# EAGLE design picWAVE (EAGLE 7.7.0)
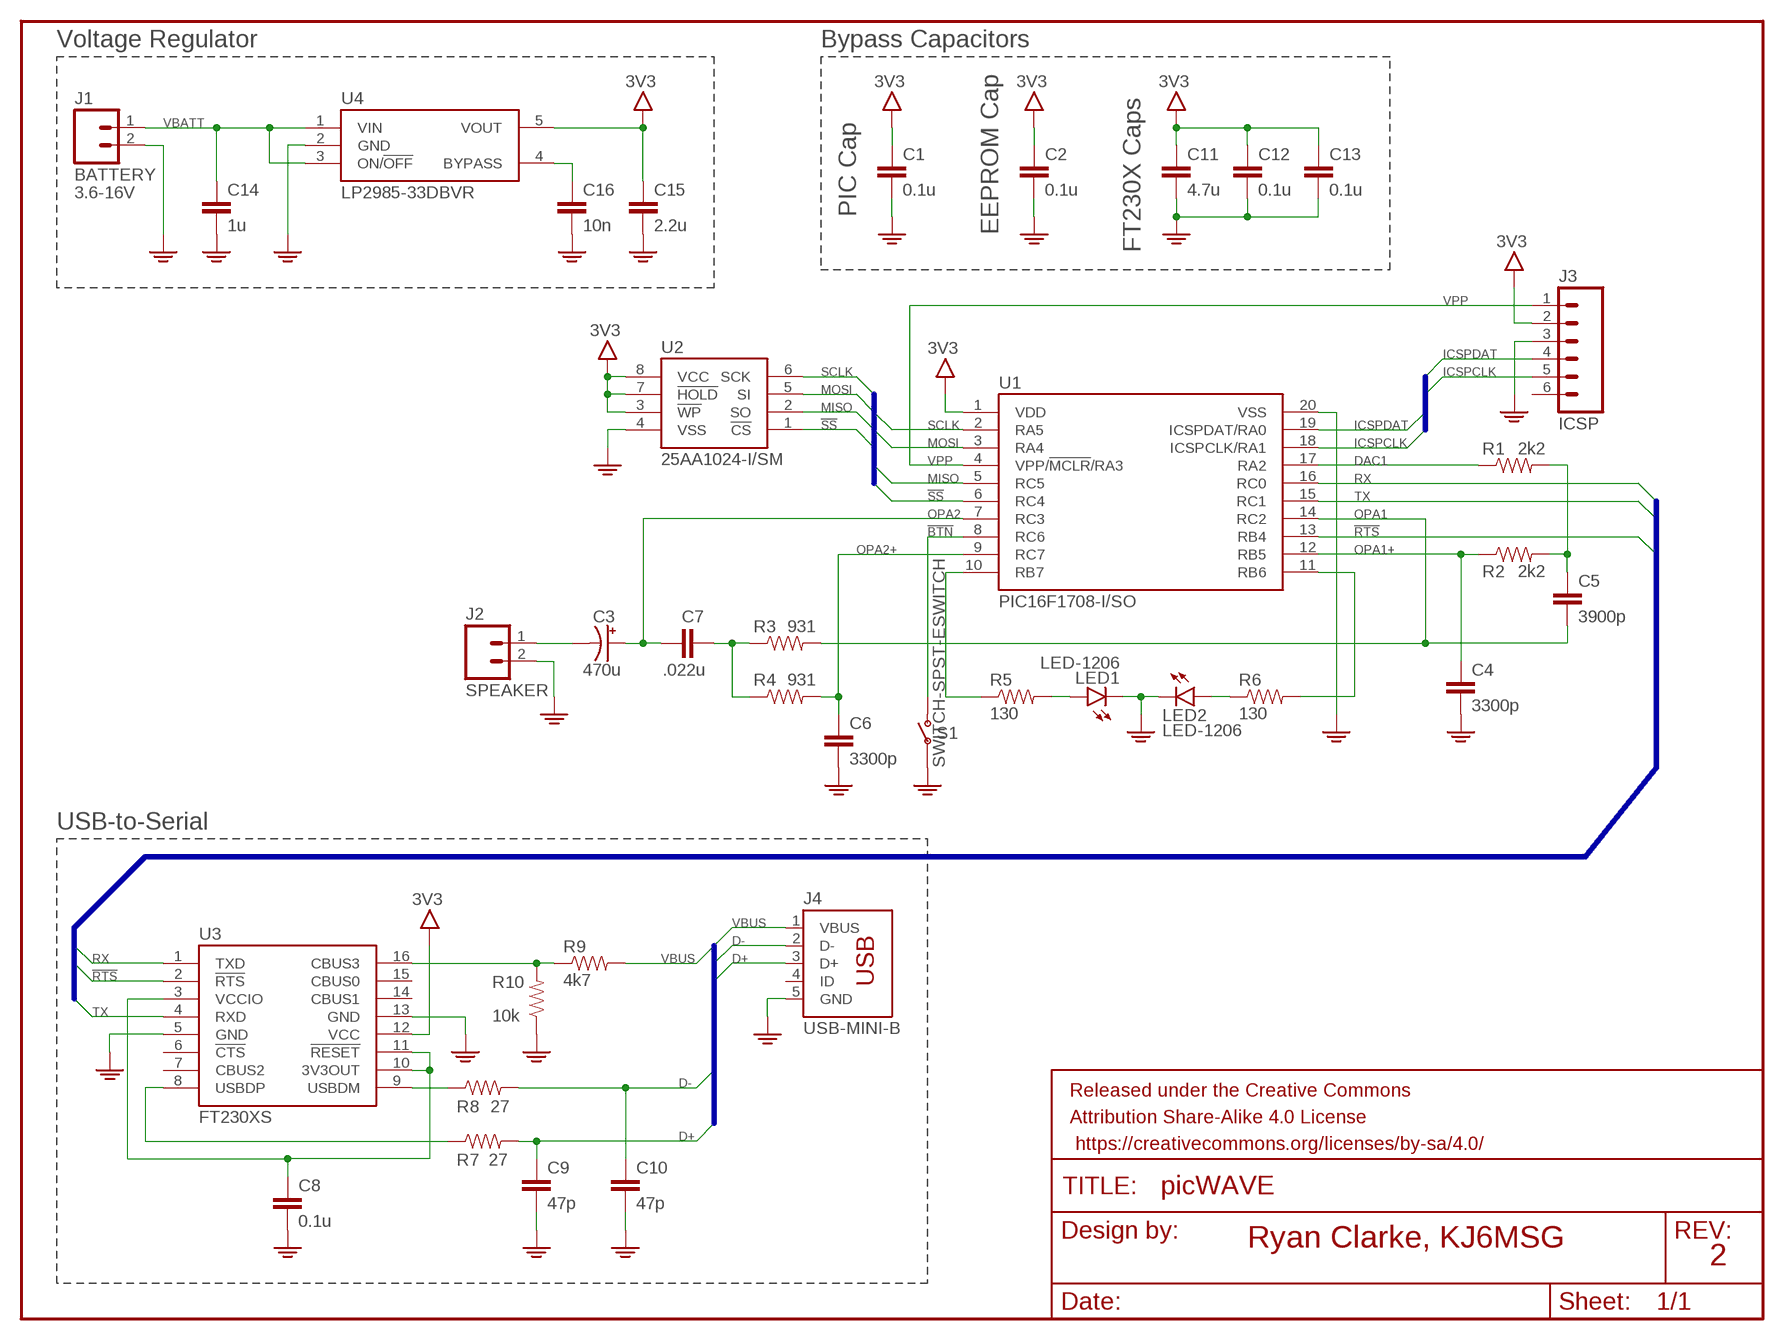
[diagram p0: schematic, sheet 1]

## Parts
C1  0.1u  CAPACITOR-1206  [1206]
C2  0.1u  CAPACITOR-1206  [1206]
C3  470u  CAPACITOR-POL-NL1GS  [NL1GS]
C4  3300p  CAPACITOR-1206  [1206]
C5  3900p  CAPACITOR-1206  [1206]
C6  3300p  CAPACITOR-1206  [1206]
C7  .022u  CAPACITOR-1206  [1206]
C8  0.1u  CAP1206  [1206@1]
C9  47p  CAP1206  [1206@1]
C10  47p  CAP1206  [1206@1]
C11  4.7u  CAP1206  [1206@1]
C12  0.1u  CAP1206  [1206@1]
C13  0.1u  CAP1206  [1206@1]
C14  1u  CAPACITOR-1206  [1206]
C15  2.2u  CAPACITOR-1206  [1206]
C16  10n  CAPACITOR-1206  [1206]
FRAME1  FRAME-LETTERNO_PACKAGE  [DUMMY]
J1  BATTERY  M02-MOLEX  [22-05-3021]
J2  SPEAKER  M02-MOLEX  [22-05-3021]
J3  ICSP  M06  [1X06]
J4  USB-MINI-B  USB-MINI-B-PTH  [XM7D-0512]
LED1  LED-1206  [LED-1206]
LED2  LED-1206  [LED-1206]
R1  2k2  RESISTOR1206  [1206]
R2  2k2  RESISTOR1206  [1206]
R3  931  RESISTOR1206  [1206]
R4  931  RESISTOR1206  [1206]
R5  130  RESISTOR1206  [1206]
R6  130  RESISTOR1206  [1206]
R7  27  RESISTOR1206  [1206]
R8  27  RESISTOR1206  [1206]
R9  4k7  RESISTOR1206  [1206]
R10  10k  RESISTOR1206  [1206]
S1  SWITCH-SPST-ESWITCH  [KS-00Q-01]
U1  PIC16F1708-I/SO  [SOIC-20-W]
U2  25AA1024-I/SM  [SOIJ-8]
U3  FT230XS  [SSOP-16]
U4  LP2985-33DBVR  LP2985  [SOT-23-5]

## Nets
3V3: C1.1 C2.1 C11.1 C12.1 C13.1 C15.1 J3.2 U1.1(VDD) U2.3(!WP!) U2.7(!HOLD!) U2.8(VCC) U3.12(VCC) U4.5(VOUT)
!BTN!: S1.2 S1.4 U1.8(RC6)
!RTS!: U1.13(RB4) U3.2(!RTS!)
!SS!: U1.6(RC4) U2.1(!CS!)
D+: C9.1 J4.3(D+) R7.2
D-: C10.1 J4.2(D-) R8.2
DAC1: R1.1 U1.17(RA2)
GND: C1.2 C2.2 C4.2 C6.2 C8.2 C9.2 C10.2 C11.2 C12.2 C13.2 C14.2 C15.2 C16.2 J1.2 J2.2 J3.3 J4.5(GND) LED1.C LED2.C R10.1 S1.1 S1.3 U1.20(VSS) U2.4(VSS) U3.5(GND) U3.13(GND) U4.2(GND)
ICSPCLK: J3.5 U1.18(ICSPCLK/RA1)
ICSPDAT: J3.4 U1.19(ICSPDAT/RA0)
LED1: R5.1 U1.10(RB7)
LED2: R6.2 U1.11(RB6)
MISO: U1.5(RC5) U2.2(SO)
MOSI: U1.3(RA4) U2.5(SI)
N$1: C16.1 U4.4(BYPASS)
N$2: R7.1 U3.8(USBDP)
N$3: C5.1 R1.2 R2.2
N$4: C7.1 R3.1 R4.1
N$5: C3.- J2.1
N$10: C8.1 U3.3(VCCIO) U3.10(3V3OUT) U3.11(!RESET!)
N$11: R8.1 U3.9(USBDM)
N$13: R9.1 R10.2 U3.16(CBUS3)
N$14: LED2.A R6.1
N$16: LED1.A R5.2
OPA1: C5.2 R3.2 U1.14(RC2)
OPA1+: C4.1 R2.1 U1.12(RB5)
OPA2: C3.+ C7.2 U1.7(RC3)
OPA2+: C6.1 R4.2 U1.9(RC7)
RX: U1.16(RC0) U3.1(TXD)
SCLK: U1.2(RA5) U2.6(SCK)
TX: U1.15(RC1) U3.4(RXD)
VBATT: C14.1 J1.1 U4.1(VIN) U4.3(ON/!OFF!)
VBUS: J4.1(VBUS) R9.2
VPP: J3.1 U1.4(VPP/!MCLR!/RA3)
Unconnected: J3.6 J4.4(ID) U3.6(!CTS!) U3.7(CBUS2) U3.14(CBUS1) U3.15(CBUS0)

## Buses
SCLK,MOSI,MISO,!SS!
TX,RX,!RTS!
ICSPDAT,ICSPCLK
VBUS,D-,D+

## Notes on the sheet
- Voltage Regulator | Bypass Capacitors
- 3.6-16V
- PIC Cap
- EEPROM Cap
- FT230X Caps
- USB-to-Serial
- Ryan Clarke, KJ6MSG
- 2

## Library data of the parts
C1 C2 C4-C7 C14-C16 = kj6msg:CAPACITOR: Capacitor SparkFun
C3 = kj6msg:CAPACITOR-POL: Polarized Capacitor SparkFun
C8-C13 = kj6msg:CAP
FRAME1 = SparkFun-Aesthetics:FRAME-LETTER: Schematic Frame Standard 8.5x11 US Letter frame; DESIGNER: Nobody; VERSION: v01
J1 J2 = kj6msg:M02: 2-pin 0.1" Header Ryan Clarke, KJ6MSG; DIGI-KEY: WM4300-ND; MANUFACTURER: Molex; PART-NO: 0022053021
J3 = kj6msg:M06: 6-pin 0.1" Header SparkFun
J4 = kj6msg:USB-MINI-B: USB mini-B Ryan Clarke, KJ6MSG
LED1 LED2 = kj6msg:LED: LED SparkFun
R1-R10 = kj6msg:RESISTOR: Resistor SparkFun
S1 = kj6msg:SWITCH-SPST: SPST Switch Ryan Clarke, KJ6MSG; DIGI-KEY: EG4788-ND; MANUFACTURER: E-Switch; PART-NO: KS-00Q-01
U1 = kj6msg:PIC16F1708-*/: Microchip PIC16F1708 20-pin, 8-bit microcontroller Ryan Clarke, KJ6MSG
U2 = kj6msg:25AA1024: Microchip 25AA1024 8-pin, 1 Mb SPI EEPROM Ryan Clarke, KJ6MSG
U3 = kj6msg:FT230X: FTDI FT230X USB to Basic UART IC Ryan Clarke, KJ6MSG
U4 = kj6msg:LP2985: LP2985 Ryan Clarke, KJ6MSG

## Board
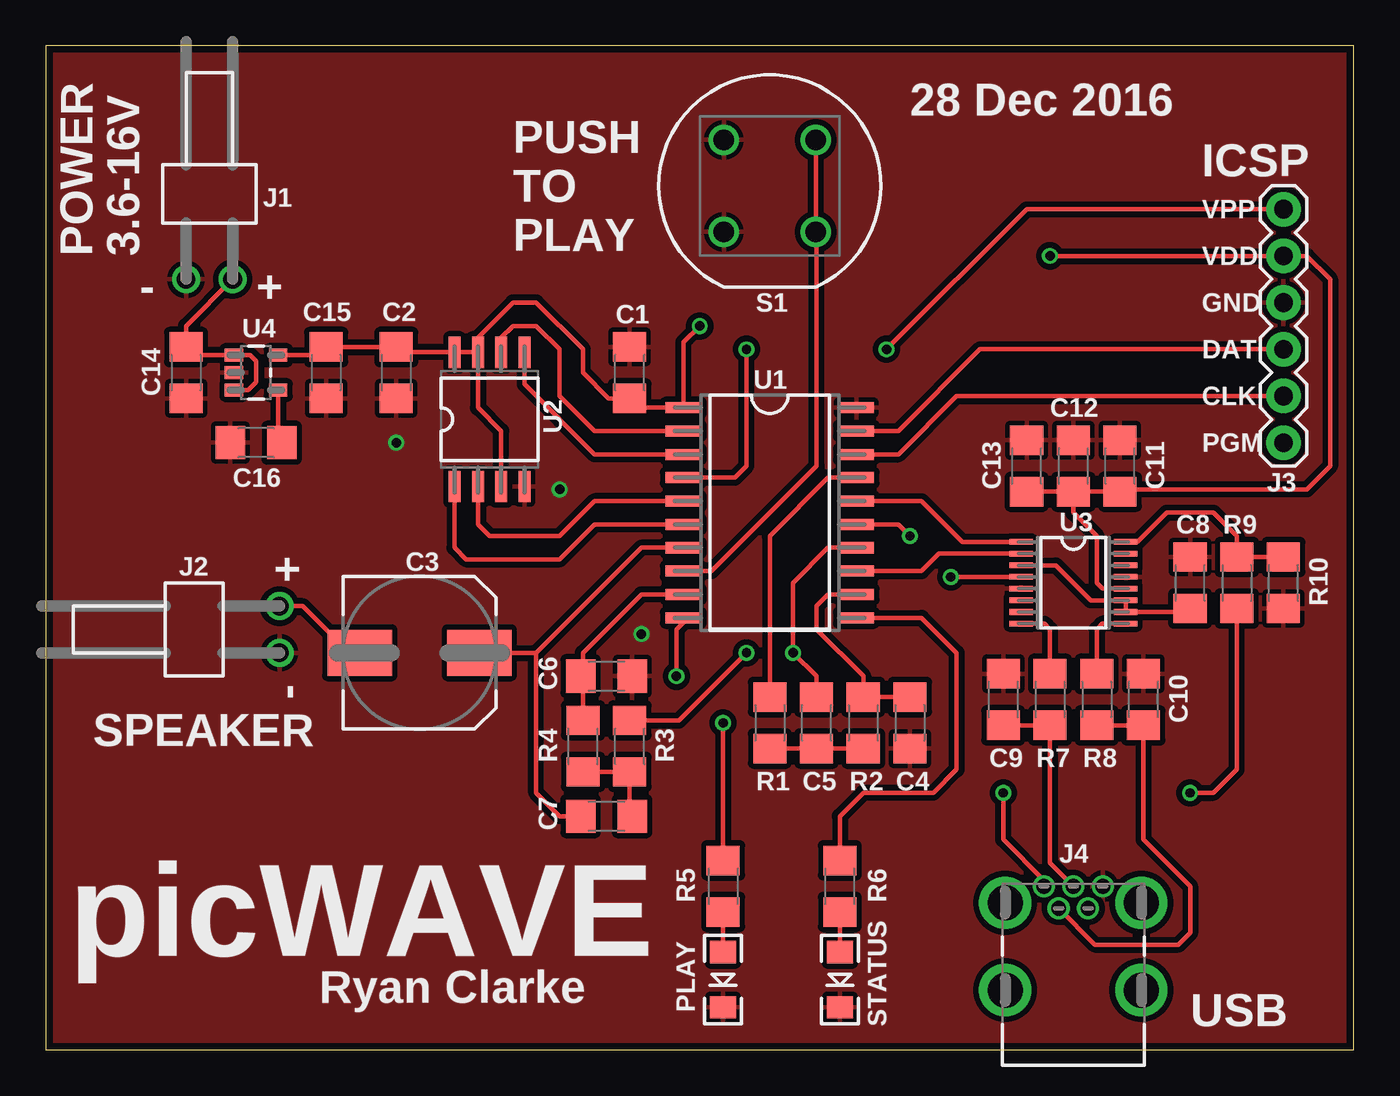
[diagram p1: board, top side]
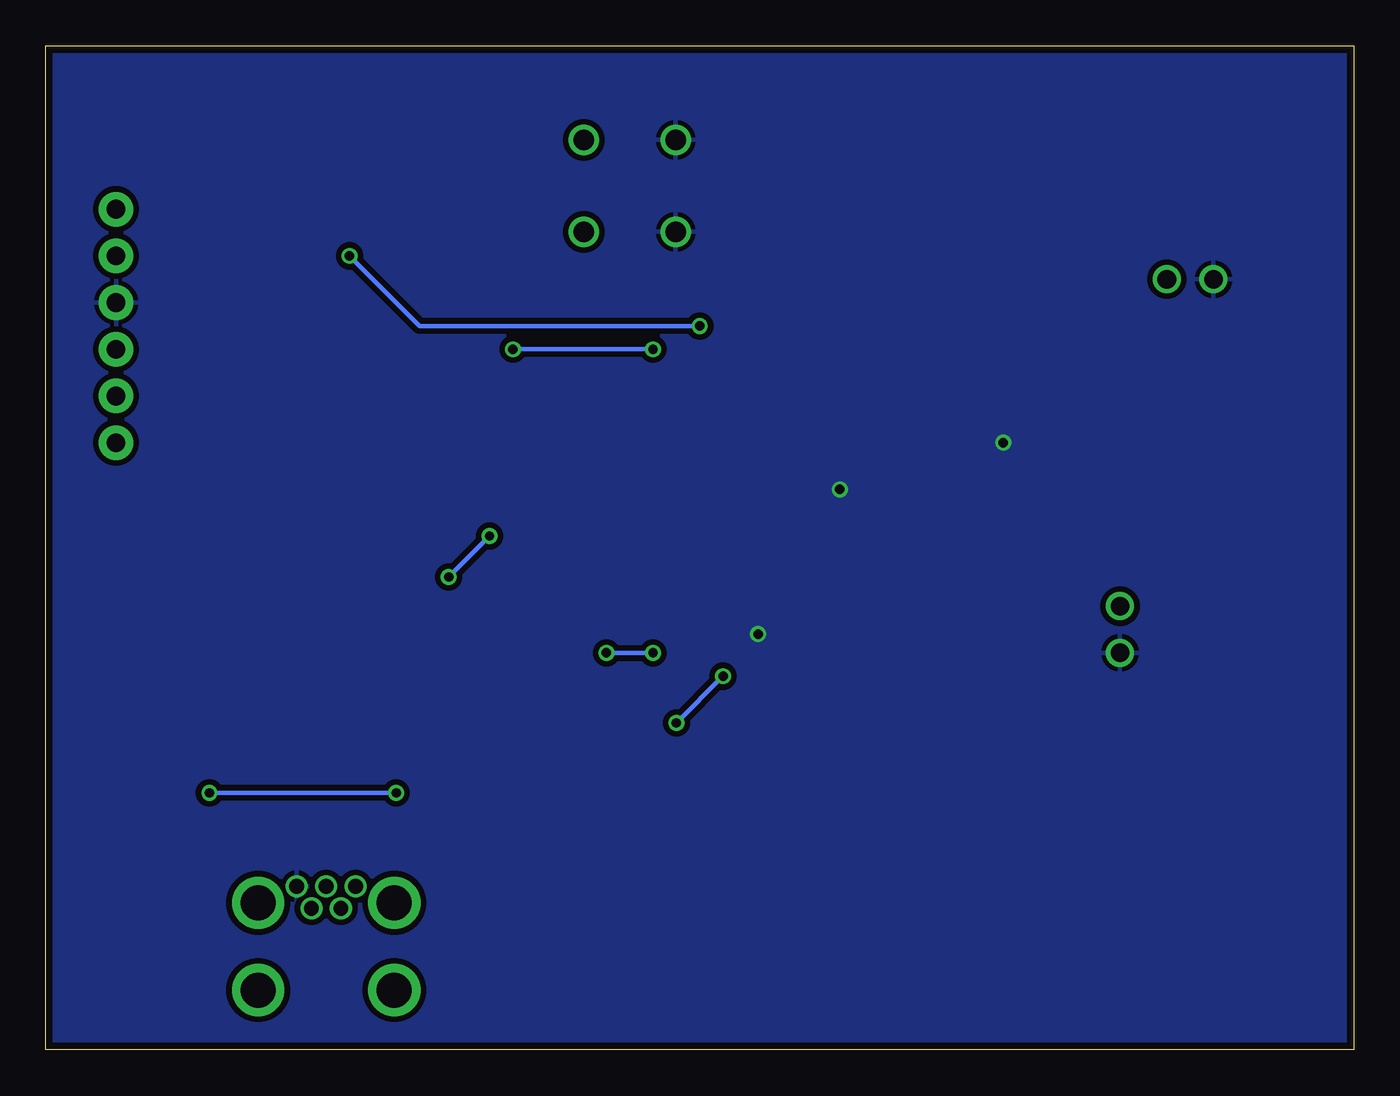
[diagram p2: board, bottom side, seen from below]

Size 71.12 x 54.6 mm. Coordinates in mm from the lower left corner, seen from the top.
Outline: 0,0 71.12,0 71.12,54.6 0,54.6 0,0
Copper layers (1*16): Top 0.0356mm / dielectric 1.5011mm / Bottom 0.0356mm
Design rules "oshpark-2layer": minimum track width 6mil, minimum drill 13mil, track to track 6mil, track to pad 6mil, pad to pad 6mil, via to via 6mil, smd to smd 6mil, copper to edge 15mil, drill to drill 6mil, minimum pad ring 7mil, minimum via ring 7mil, stop-mask expansion 2.5mil, vias tented up to drill 0mil, thermal gap 10mil

### Footprints (pad centres in the part's own frame; a part is rotated, then mirrored left to right if it is on the bottom)
1206 = smd 1.6 x 1.8: 1 -1.4,0; 2 1.4,0
NL1GS = smd 2.5 x 3.5: + 0,3.25; - 0,-3.25
1206@1 = smd 1.6 x 1.8: 1 -1.4,0; 2 1.4,0
22-05-3021 = drill 1.016: 1 1.27,0; 2 -1.27,0
1X06 = drill 1.016 pad 1.88: 1 0,0; 2 2.54,0; 3 5.08,0; 4 7.62,0; 5 10.16,0; 6 12.7,0
XM7D-0512 = drill 0.8: 1 1.6,0; 2 0.8,1.2; 3 0,0; 4 -0.8,1.2; 5 -1.6,0 | drill 1.9: P$1 -3.7,0.9; P$2 3.7,0.9; P$3 -3.7,5.65; P$4 3.7,5.65
LED-1206 = smd 1.2 x 1.4: A -1.5,0; C 1.5,0
KS-00Q-01 = drill 1.1: 1 -2.5,2.5; 2 2.5,2.5; 3 -2.5,-2.5; 4 2.5,-2.5
SOIC-20-W = smd 0.6 x 1.95: 1 -5.715,-4.7; 2 -4.445,-4.7; 3 -3.175,-4.7; 4 -1.905,-4.7; 5 -0.635,-4.7; 6 0.635,-4.7; 7 1.905,-4.7; 8 3.175,-4.7; 9 4.445,-4.7; 10 5.715,-4.7; 11 5.715,4.7; 12 4.445,4.7; 13 3.175,4.7; 14 1.905,4.7; 15 0.635,4.7; 16 -0.635,4.7; 17 -1.905,4.7; 18 -3.175,4.7; 19 -4.445,4.7; 20 -5.715,4.7
SOIJ-8 = smd 0.65 x 1.7: 1 -1.905,-3.65; 2 -0.635,-3.65; 3 0.635,-3.65; 4 1.905,-3.65; 5 1.905,3.65; 6 0.635,3.65; 7 -0.635,3.65; 8 -1.905,3.65
SSOP-16 = smd 0.305 x 1.27: 1 -2.223,-2.845; 2 -1.587,-2.845; 3 -0.953,-2.845; 4 -0.318,-2.845; 5 0.318,-2.845; 6 0.953,-2.845; 7 1.587,-2.845; 8 2.223,-2.845; 9 2.223,2.845; 10 1.587,2.845; 11 0.953,2.845; 12 0.318,2.845; 13 -0.318,2.845; 14 -0.953,2.845; 15 -1.587,2.845; 16 -2.223,2.845
SOT-23-5 = smd 0.7 x 1: 1 -0.95,-1.2; 2 0,-1.2; 3 0.95,-1.2; 4 0.95,1.2; 5 -0.95,1.2

### Placement (x,y rotation side)
C1  31.75,36.83 90 top
C2  19.05,36.83 270 top
C3  20.32,21.59 270 top
C4  46.99,17.78 270 top
C5  41.91,17.78 90 top
C6  30.48,20.32 0 top
C7  30.48,12.7 180 top
C8  62.23,25.4 90 top
C9  52.07,19.05 90 top
C10  59.69,19.05 90 top
C11  58.42,31.75 90 top
C12  55.88,31.75 90 top
C13  53.34,31.75 90 top
C14  7.62,36.83 270 top
C15  15.24,36.83 270 top
C16  11.43,33.02 180 top
FRAME1  1.27,53.34 0 top
J1  8.89,41.91 0 top
J2  12.7,22.86 90 top
J3  67.31,45.72 270 top
J4  55.88,8.89 180 top
LED1  36.83,3.81 270 top
LED2  43.18,3.81 270 top
R1  39.37,17.78 270 top
R2  44.45,17.78 270 top
R3  31.75,16.51 90 top
R4  29.21,16.51 90 top
R5  36.83,8.89 270 top
R6  43.18,8.89 90 top
R7  54.61,19.05 270 top
R8  57.15,19.05 270 top
R9  64.77,25.4 270 top
R10  67.31,25.4 90 top
S1  39.37,46.99 0 top
U1  39.37,29.21 270 top
U2  24.13,34.29 0 top
U3  55.88,25.4 270 top
U4  11.43,36.83 270 top

### Tracks (layer width: path | path; a pad name or v marks a point on that pad's centre or on a via)
3V3  (via drill 0.51)
  Top 0.254: U4.5 14.79,37.78 C15.1 C2.1 19.34,37.94 U2.8 U2.7 | U2.7 23.5,34.92 24.77,33.66 U2.3 | C12.1 C11.1 58.55,30.48 68.58,30.48 69.85,31.75 69.85,41.91 68.58,43.18 J3.2 v54.61,43.18 | C12.1 C13.1 | U3.12 57.47,25.08 57.15,25.4 57.15,27.94 55.88,29.21 C12.1 | U2.7 23.5,38.73 25.4,40.64 26.67,40.64 29.21,38.1 29.21,36.83 30.61,35.43 C1.1 32.26,34.92 U1.1 34.67,38.48 v35.56,39.37
  Bottom 0.254: v35.56,39.37 50.8,39.37 v54.61,43.18
!BTN!
  Top 0.254: U1.8 36.2,26.04 41.91,31.75 41.91,44.45 S1.4 S1.2
!RTS!
  Top 0.254: U1.13 47.62,26.04 48.58,26.99 U3.2
!SS!
  Top 0.254: U2.1 22.23,27.3 22.86,26.67 27.94,26.67 29.84,28.57 U1.6
D+
  Top 0.254: C9.1 R7.2 54.61,10.16 J4.3
D-
  Top 0.254: R8.2 C10.1 59.69,11.43 62.23,8.89 62.23,6.35 61.59,5.71 57.05,5.71 J4.2
DAC1
  Top 0.254: U1.17 42.55,31.11 39.37,27.94 R1.1
GND  (via drill 0.51)
  other vias: 19.05,33.02 27.94,30.48 32.38,22.61
  pour Top (isolate 0.305): 0,54.61 71.12,54.61 71.12,0 0,0
  pour Bottom (isolate 0.305): 0,54.61 71.12,54.61 71.12,0 0,0
ICSPCLK
  Top 0.254: U1.18 46.35,32.38 49.53,35.56 J3.5
ICSPDAT
  Top 0.254: U1.19 46.35,33.66 50.8,38.1 J3.4
LED1  (via drill 0.51)
  Top 0.254: U1.10 34.67,23.24 34.29,22.86 v34.29,20.32 | v36.83,17.78 R5.1
  Bottom 0.254: v34.29,20.32 v36.83,17.78
LED2
  Top 0.254: U1.11 47.62,23.5 49.53,21.59 49.53,15.24 48.26,13.97 44.45,13.97 43.18,12.7 R6.2
MISO
  Top 0.254: U2.2 23.5,28.57 24.13,27.94 27.94,27.94 29.84,29.84 U1.5
MOSI
  Top 0.254: U2.5 26.04,36.2 29.84,32.38 U1.3
N$1
  Top 0.254: U4.4 12.63,33.22 C16.1
N$2
  Top 0.254: U3.8 54.29,23.18 54.61,22.86 R7.1
N$3
  Top 0.254: R2.2 C5.1 R1.2
N$4
  Top 0.254: R4.1 R3.1 31.75,12.83 C7.1
N$5
  Top 0.254: 16.51,21.59 13.97,24.13 J2.1
  Top 0.406: C3.- 16.51,21.59
N$10
  Top 0.254: U3.3 54.93,26.35 56.83,24.45 U3.11 U3.10 62.04,23.81 C8.1
N$11
  Top 0.254: U3.9 57.47,23.18 57.15,22.86 R8.1
N$13
  Top 0.254: R10.2 R9.1 64.77,27.94 63.5,29.21 60.96,29.21 59.37,27.62 U3.16
N$14
  Top 0.254: LED2.A R6.1
N$16
  Top 0.254: LED1.A R5.2
OPA1  (via drill 0.51)
  Top 0.254: U1.14 42.55,27.3 40.64,25.4 v40.64,21.59 41.91,20.32 C5.2 | R3.2 34.42,17.91 v38.1,21.59
  Bottom 0.254: v40.64,21.59 v38.1,21.59
OPA1+
  Top 0.254: C4.1 R2.1 44.45,20.32 41.91,22.86 41.91,24.13 42.55,24.77 U1.12
OPA2
  Top 0.254: C7.2 27.94,12.7 26.67,13.97 26.67,21.59 | 26.67,21.59 32.38,27.3 U1.7 | C3.+ 26.67,21.59
OPA2+
  Top 0.254: R4.2 29.21,20.19 C6.1 29.21,20.45 29.21,21.59 32.38,24.77 U1.9
RX
  Top 0.254: U1.16 47.62,29.84 49.85,27.62 U3.1
SCLK
  Top 0.254: U2.6 24.77,38.73 25.4,39.37 26.67,39.37 27.94,38.1 27.94,35.56 29.84,33.66 U1.2
TX  (via drill 0.51)
  Top 0.254: U1.15 46.35,28.57 v46.99,27.94 | U3.4 v49.21,25.72
  Bottom 0.254: v46.99,27.94 v49.21,25.72
VBATT
  Top 0.254: U4.3 10.99,35.88 11.43,36.32 11.43,37.47 11.12,37.78 U4.1 8.07,37.78 C14.1 7.62,39.37 J1.1
VBUS  (via drill 0.51)
  Top 0.254: R9.2 64.77,15.24 63.5,13.97 v62.23,13.97 | J4.1 54.28,9.22 52.07,11.43 v52.07,13.97
  Bottom 0.254: v52.07,13.97 v62.23,13.97
VPP  (via drill 0.51)
  Top 0.254: U1.4 37.47,31.11 38.1,31.75 v38.1,38.1 | v45.72,38.1 53.34,45.72 J3.1
  Bottom 0.254: v38.1,38.1 v45.72,38.1

### Text on the board
tPlace: 28 Dec 2016 | ICSP | J1 | VPP | POWER | 3.6-16V | PUSH / TO / PLAY | VDD | - | + | C15 | C2 | S1 | GND | U4 | C1 | DAT | C14 | U1 | CLK | U2 | C12 | PGM | C16 | C13 | C11 | J3 | U3 | C8 | R9 | J2 | C3 | + | R10 | C6 | - | C10 | SPEAKER | R4 | R3 | C9 | R7 | R8 | R1 | C5 | R2 | C4 | C7 | J4 | R5 | R6 | picWAVE | Ryan Clarke | PLAY | STATUS | USB